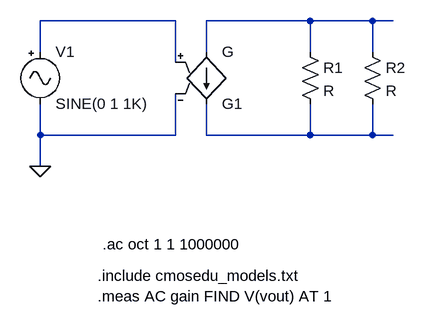
[diagram p0: schematic pequenossinais.asc]
pequenossinais.asc, the LTspice schematic file:
Version 4
SHEET 1 880 680
WIRE -2096 -800 -2304 -800
WIRE -1888 -800 -2048 -800
WIRE -1792 -800 -1888 -800
WIRE -1760 -800 -1792 -800
WIRE -2304 -752 -2304 -800
WIRE -2048 -752 -2048 -800
WIRE -1888 -752 -1888 -800
WIRE -1792 -752 -1792 -800
WIRE -2096 -736 -2096 -800
WIRE -2304 -624 -2304 -672
WIRE -2096 -624 -2096 -688
WIRE -2096 -624 -2304 -624
WIRE -2048 -624 -2048 -672
WIRE -1888 -624 -1888 -672
WIRE -1888 -624 -2048 -624
WIRE -1792 -624 -1792 -672
WIRE -1792 -624 -1888 -624
WIRE -1760 -624 -1792 -624
WIRE -2304 -576 -2304 -624
FLAG -2304 -576 0
SYMBOL Misc\\signal -2304 -768 R0
SYMATTR InstName V1
SYMBOL g2 -2048 -656 M180
SYMATTR InstName G1
SYMBOL res -1904 -768 R0
SYMATTR InstName R1
SYMBOL res -1808 -768 R0
SYMATTR InstName R2
TEXT -2208 -456 Left 2 !.ac oct 1 1 1000000
TEXT -2216 -408 Left 2 !.include cmosedu_models.txt
TEXT -2216 -376 Left 2 !.meas AC gain FIND V(vout) AT 1

The netlist it stands for:
* pequenossinais.asc
V1 N001 0 SINE(0 1 1K)
G1 N002 N003 N001 0 G
R1 N002 N003 R
R2 N002 N003 R
.ac oct 1 1 1000000
.include cmosedu_models.txt
.meas AC gain FIND V(vout) AT 1
.backanno
.end